# EAGLE schematic pikachu_pcb (EAGLE 9.6.2)
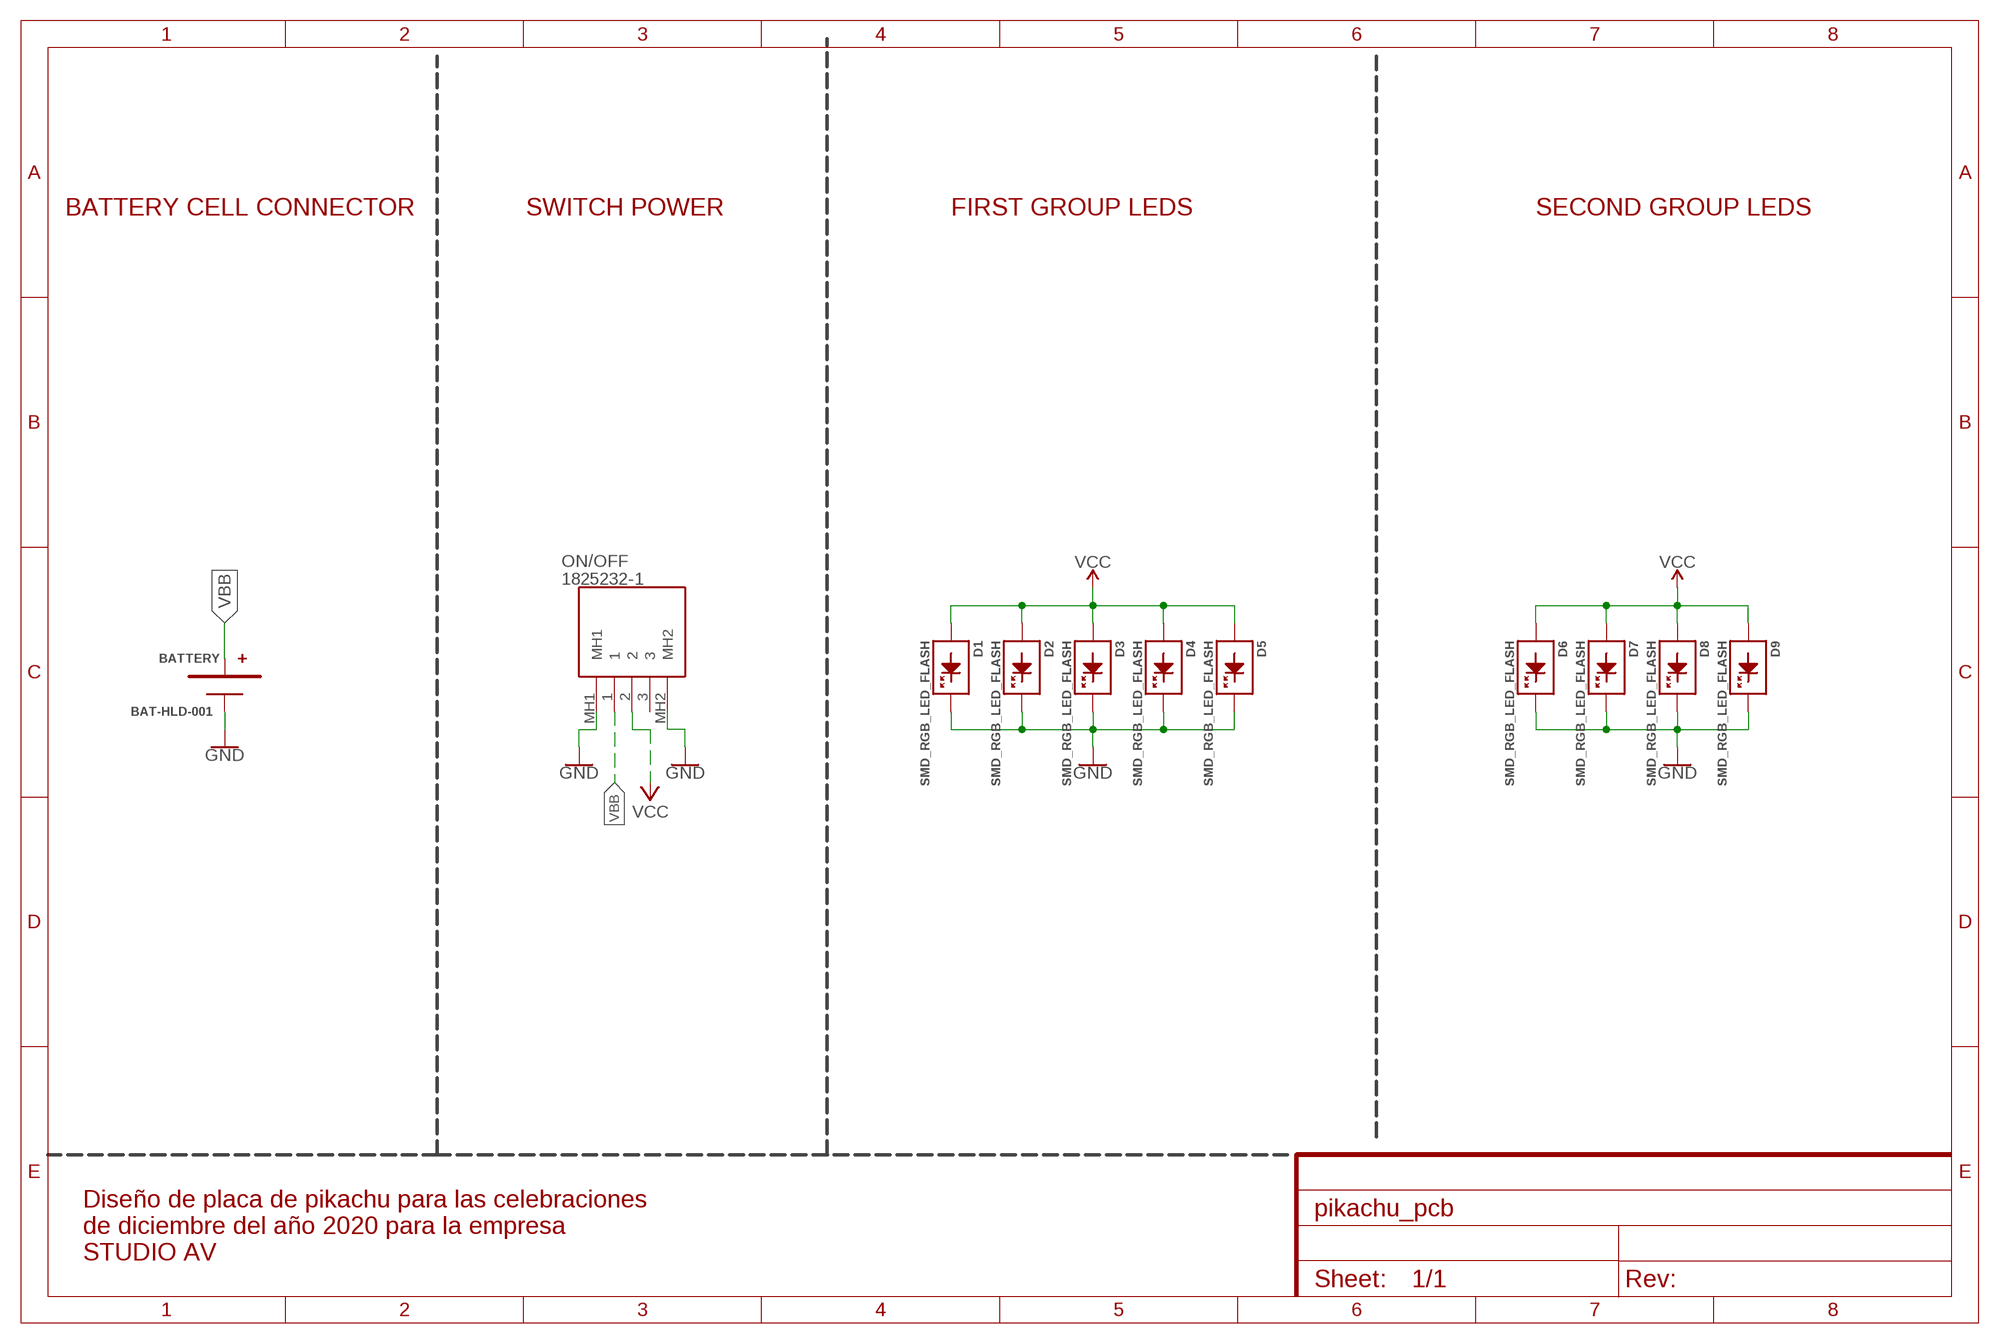
[diagram p0: schematic, sheet 1]

## Parts
BATTERY  BAT-HLD-001  [BATHLD001]
D1  SMD_RGB_LED_FLASH  [SMD_RGB_LED_0807]
D2  SMD_RGB_LED_FLASH  [SMD_RGB_LED_0807]
D3  SMD_RGB_LED_FLASH  [SMD_RGB_LED_0807]
D4  SMD_RGB_LED_FLASH  [SMD_RGB_LED_0807]
D5  SMD_RGB_LED_FLASH  [SMD_RGB_LED_0807]
D6  SMD_RGB_LED_FLASH  [SMD_RGB_LED_0807]
D7  SMD_RGB_LED_FLASH  [SMD_RGB_LED_0807]
D8  SMD_RGB_LED_FLASH  [SMD_RGB_LED_0807]
D9  SMD_RGB_LED_FLASH  [SMD_RGB_LED_0807]
ON/OFF  1825232-1  [18252321]

## Nets
GND: BATTERY.3(N) D1.3(K) D1.4(K) D2.3(K) D2.4(K) D3.3(K) D3.4(K) D4.3(K) D4.4(K) D5.3(K) D5.4(K) D6.3(K) D6.4(K) D7.3(K) D7.4(K) D8.3(K) D8.4(K) D9.3(K) D9.4(K) ON/OFF.MH1
N$3: ON/OFF.MH2 ; supply symbol labelled GND
VBB: BATTERY.1(P) BATTERY.2(P) ON/OFF.1
VCC: D1.1(A) D1.2(A) D2.1(A) D2.2(A) D3.1(A) D3.2(A) D4.1(A) D4.2(A) D5.1(A) D5.2(A) D6.1(A) D6.2(A) D7.1(A) D7.2(A) D8.1(A) D8.2(A) D9.1(A) D9.2(A) ON/OFF.2
Unconnected: ON/OFF.3

## Notes on the sheet
- BATTERY CELL CONNECTOR | SWITCH POWER | FIRST GROUP LEDS | SECOND GROUP LEDS
- Diseño de placa de pikachu para las celebraciones 
  de diciembre del año 2020 para la empresa
  STUDIO AV

## Library data of the parts
BATTERY = FL-Battery:BAT-HLD-001: Soporte para baterías de botón Linx CR2032 Battery Holder, Tape n Reel; DATASHEET: https://www.mouser.mx/datasheet/2/238/bat_hld_001-1659379.pdf; LCSC#PART: -; MANUFACTURER#PART: BAT-HLD-001-TR; MANUFACTURER_NAME: Linx Technologies; MOUSER#PART: 712-BAT-HLD-001-TR; PACKAGE: SMD
D1-D9 = FL-Led:SMD_RGB_LED_FLASH: 0807 RGB Led Lamp SMD, RGB Slow Flashing Diode, Colorful Diodes, DIY Flash; DATASHEET: https://es.aliexpress.com/item/32829140495.html?spm=a2g0s.9042311.0.0.32vRd6; LCSC#PART: -; MANUFACTURER#PART: -; MANUFACTURER_NAME: -; MOUSER#PART: -; PACKAGE: 0807
ON/OFF = 1825232-1:1825232-1: TE CONNECTIVITY - 1825232-1 - SLIDE SWITCH, SPDT, 0.2A, 30VDC, SOLDER Source: Datasheet <https://componentsearchengine.com/Datasheets/1/1825232-1.pdf>; ARROW_PART_NUMBER: 1825232-1; ARROW_PRICE-STOCK: https://www.arrow.com/en/products/1825232-1/te-connectivity; DESCRIPTION: TE CONNECTIVITY - 1825232-1 - SLIDE SWITCH, SPDT, 0.2A, 30VDC, SOLDER; HEIGHT: 3.7mm; MANUFACTURER_NAME: TE Connectivity; MANUFACTURER_PART_NUMBER: 1825232-1; MOUSER_PART_NUMBER: 655-1825232-1; MOUSER_PRICE-STOCK: https://www.mouser.co.uk/ProductDetail/TE-Connectivity-PB/1825232-1?qs=kTKVN3NWb5FosGxaNC1%252BtA%3D%3D